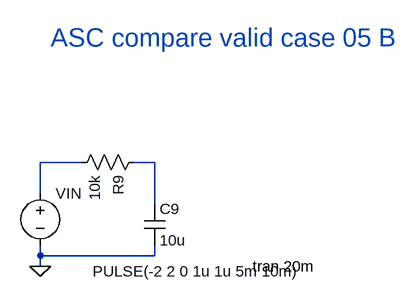
[diagram p0: schematic valid_case_05_b.asc]
valid_case_05_b.asc, the LTspice schematic file:
Version 4.1
SHEET 1 880 680
WIRE 128 96 64 96
WIRE 240 96 208 96
WIRE 64 144 64 96
WIRE 240 160 240 96
WIRE 64 240 64 224
WIRE 240 240 240 224
WIRE 240 240 64 240
WIRE 64 256 64 240
FLAG 64 256 0
SYMBOL res 224 80 R90
SYMATTR InstName R9
SYMATTR Value 10k
SYMBOL cap 224 160 R0
SYMATTR InstName C9
SYMATTR Value 10u
SYMBOL voltage 64 128 R0
WINDOW 123 0 0 Left 2
WINDOW 39 0 0 Left 2
WINDOW 3 81 136 Left 2
SYMATTR InstName VIN
SYMATTR Value PULSE(-2 2 0 1u 1u 5m 10m)
TEXT 384 256 Left 2 !.tran 20m
TEXT 80 -96 Left 4 ;ASC compare valid case 05 B

The netlist it stands for:
* valid_case_05_b.asc
R9 N002 N001 10k
C9 N002 0 10u
VIN N001 0 PULSE(-2 2 0 1u 1u 5m 10m)
.tran 20m
* ASC compare valid case 05 B
.backanno
.end